# Altium project HYDRA_V4_POWER.PrjPcb (part 2 of 2)

## Sheet HYDRA_REGULATORS.SchDoc
size B; SheetNumber: 5; SheetTotal: 11
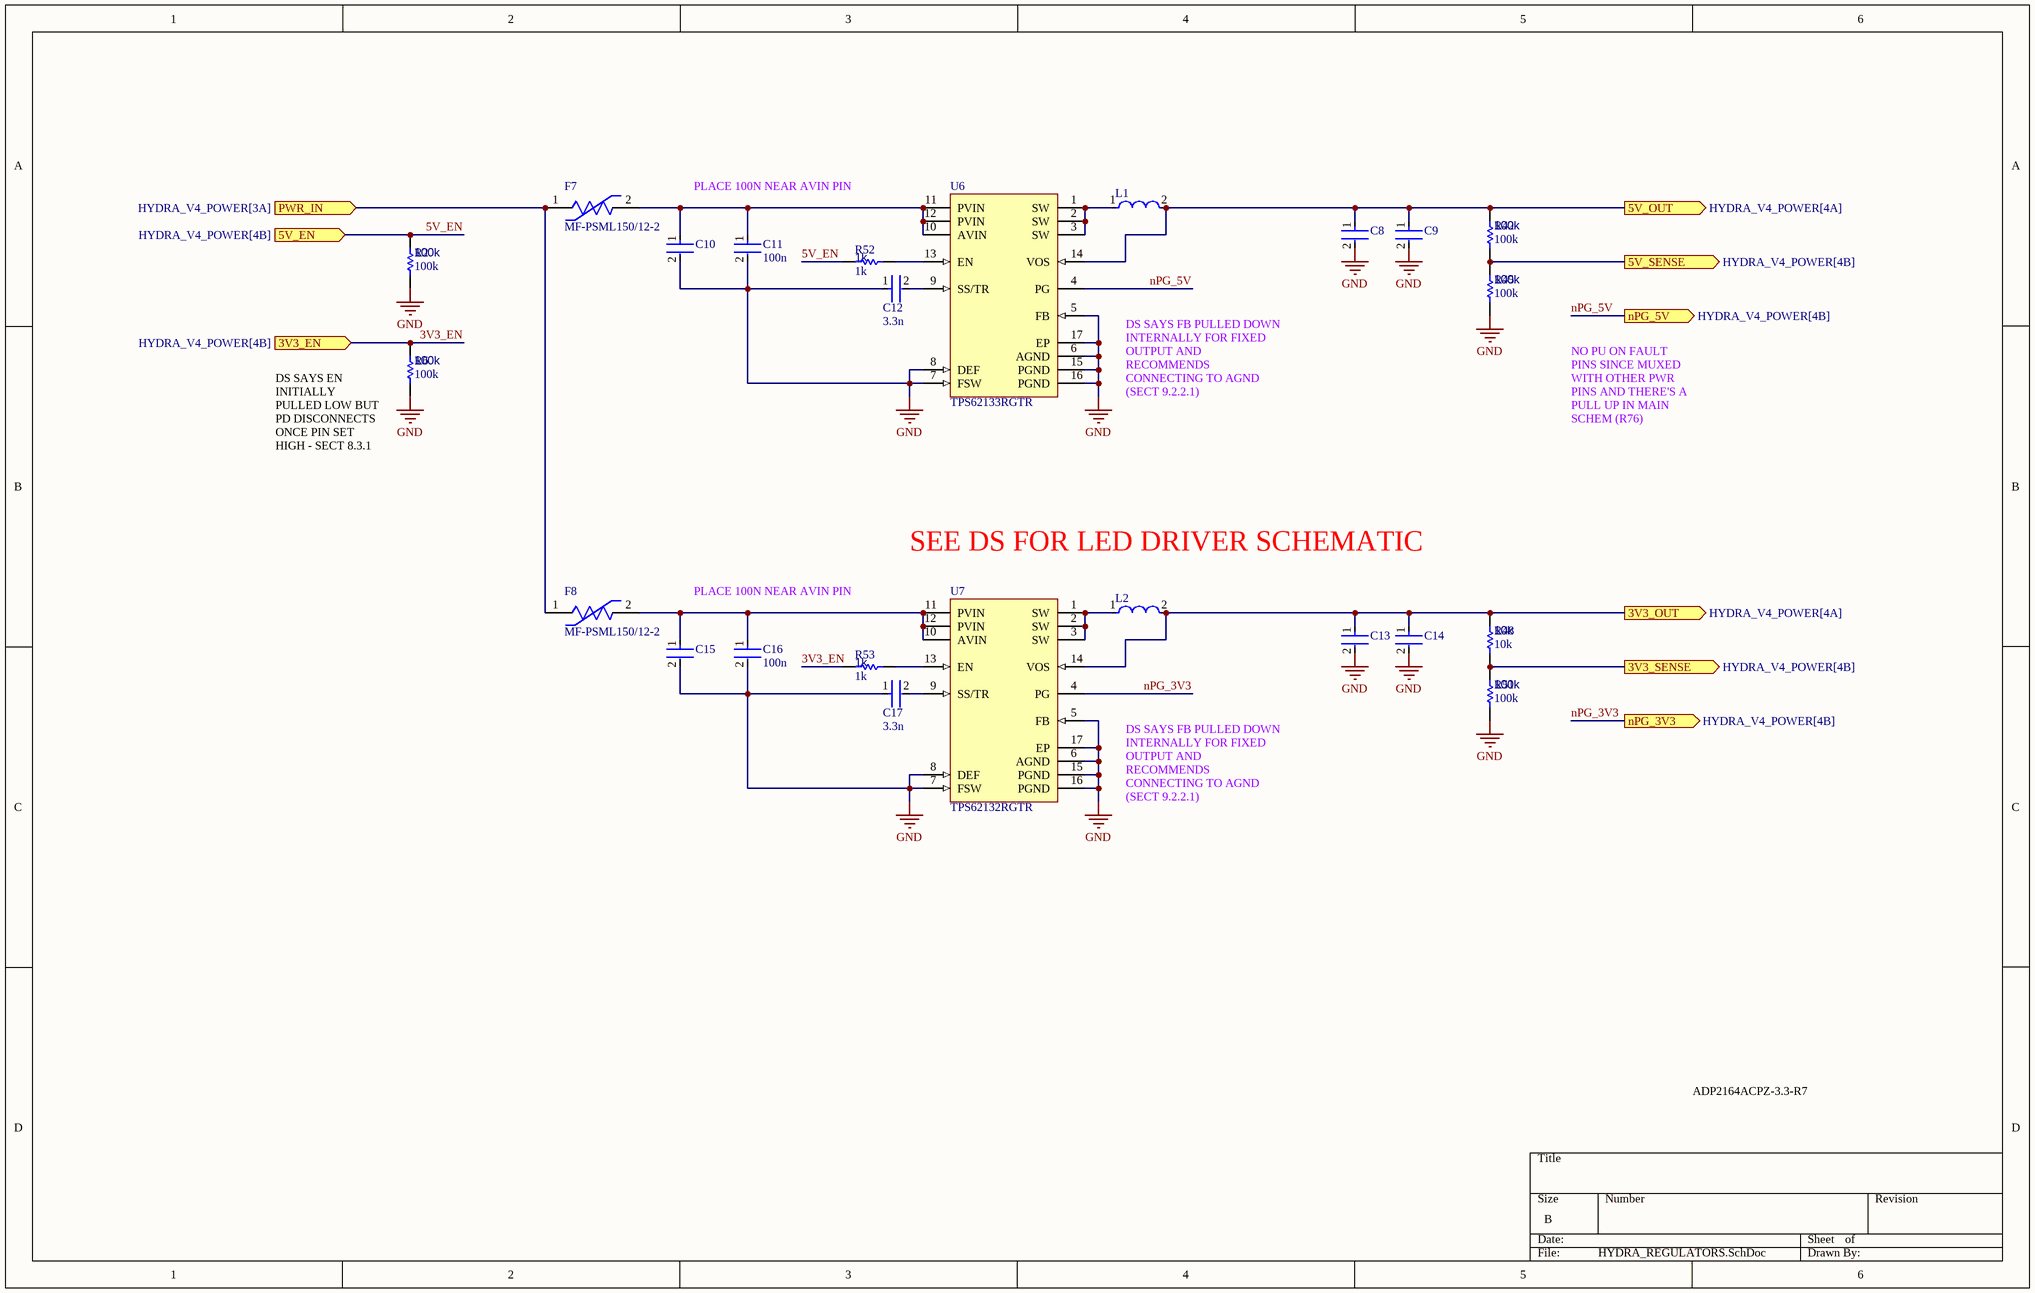
[diagram p10: HYDRA_REGULATORS.SchDoc]

### Parts
C8  GRM21BR61E226ME44L  [FP-GRM21B-0_2-e0_2_0_7-IPC_B]  (value not drawn)
C9  TMK212BBJ106KG-T  [FP-0805-L_2_0_0_2-W_1_25-MFG]  (value not drawn)
C10  TMK212BBJ106KG-T  [FP-0805-L_2_0_0_2-W_1_25-MFG]  (value not drawn)
C11  100n  [FP-0402-L_1_0_0_05-W_0_5-IPC_A]
C12  3.3n  [FP-0402-L_1_0_0_05-W_0_5-IPC_A]
C13  GRM21BR61E226ME44L  [FP-GRM21B-0_2-e0_2_0_7-IPC_B]  (value not drawn)
C14  TMK212BBJ106KG-T  [FP-0805-L_2_0_0_2-W_1_25-MFG]  (value not drawn)
C15  TMK212BBJ106KG-T  [FP-0805-L_2_0_0_2-W_1_25-MFG]  (value not drawn)
C16  100n  [FP-0402-L_1_0_0_05-W_0_5-IPC_A]
C17  3.3n  [FP-0402-L_1_0_0_05-W_0_5-IPC_A]
F7  MF-PSML150/12-2  [FP-MF-PSMF-MFG]
F8  MF-PSML150/12-2  [FP-MF-PSMF-MFG]
L1  IHLP1212BZER2R2M11  [FP-IHLP-1212BZ-11-MFG]  (value not drawn)
L2  IHLP1212BZER2R2M11  [FP-IHLP-1212BZ-11-MFG]  (value not drawn)
R2  100k  [R0603B]
R6  100k  [R0603B]
R42  100k  [R0603B]
R45  100k  [R0603B]
R48  10k  [R0603B]
R51  100k  [R0603B]
R52  1k  [R0603B]
R53  1k  [R0603B]
U6  TPS62133RGTR  [RGT0016C_V]
U7  TPS62132RGTR  [RGT0016C_V]

### Ports
3V3_EN (in, see HYDRA_V4_POWER[4B]), 3V3_OUT (out, see HYDRA_V4_POWER[4A]), 3V3_SENSE (out, see HYDRA_V4_POWER[4B]), 5V_EN (in, see HYDRA_V4_POWER[4B]), 5V_OUT (out, see HYDRA_V4_POWER[4A]), 5V_SENSE (out, see HYDRA_V4_POWER[4B]), nPG_3V3 (out, see HYDRA_V4_POWER[4B]), nPG_5V (out, see HYDRA_V4_POWER[4B]), PWR_IN (in, see HYDRA_V4_POWER[3A])

### Nets
GND: C8.2 C9.2 C10.2 C11.2 C12.1 C13.2 C14.2 C15.2 C16.2 C17.1 R2.2 R6.2 R45.1 R51.1 U6.5(FB) U6.6(AGND) U6.7(FSW) U6.8(DEF) U6.15(PGND) U6.16(PGND) U6.17(EP) U7.5(FB) U7.6(AGND) U7.7(FSW) U7.8(DEF) U7.15(PGND) U7.16(PGND) U7.17(EP)
3V3_EN: R6.1 R53.2 ; port 3V3_EN
5V_EN: R2.1 R52.2 ; port 5V_EN
M3_PWR: F7.1 F8.1 ; port PWR_IN
nPG_3V3: U6.4(PG) U7.4(PG) ; port nPG_5V, port nPG_3V3  [also labelled nPG_5V]  [project net M2_I_nFAULT]
NetC8_1: C8.1 C9.1 L1.2 R42.2 U6.14(VOS) ; port 5V_OUT
NetC10_1: C10.1 C11.1 F7.2 U6.10(AVIN) U6.11(PVIN) U6.12(PVIN)
NetC12_2: C12.2 U6.9(SS/TR)
NetC13_1: C13.1 C14.1 L2.2 R48.2 U7.14(VOS) ; port 3V3_OUT
NetC15_1: C15.1 C16.1 F8.2 U7.10(AVIN) U7.11(PVIN) U7.12(PVIN)
NetC17_2: C17.2 U7.9(SS/TR)
NetL1_1: L1.1 U6.1(SW) U6.2(SW) U6.3(SW)
NetL2_1: L2.1 U7.1(SW) U7.2(SW) U7.3(SW)
NetR42_1: R42.1 R45.2 ; port 5V_SENSE
NetR48_1: R48.1 R51.2 ; port 3V3_SENSE
NetR52_1: R52.1 U6.13(EN)
NetR53_1: R53.1 U7.13(EN)

### Notes on the sheet
- PLACE 100N NEAR AVIN PIN
- DS SAYS FB PULLED DOWN INTERNALLY FOR FIXED OUTPUT AND RECOMMENDS CONNECTING TO AGND (SECT 9.2.2.1)
- NO PU ON FAULT PINS SINCE MUXED WITH OTHER PWR PINS AND THERE'S A PULL UP IN MAIN SCHEM (R76)
- (near R6) DS SAYS EN INITIALLY PULLED LOW BUT PD DISCONNECTS ONCE PIN SET HIGH - SECT 8.3.1
- SEE DS FOR LED DRIVER SCHEMATIC
- ADP2164ACPZ-3.3-R7

### Library data of the parts
C8 C13 = CMP-2007-03222-3: Chip Multilayer Ceramic Capacitors for General Purpose, 0805, 22uF, X5R, 15%, 20%, 25V; Case/Package: 0805; Depth: 1.25mm; Resistor Type: Ceramic; Voltage Rating: 25V; Lead Free: Lead Free; Voltage Rating (DC): 25V; Case Code (Metric): 2012; Thickness: 0.057inch; REACH SVHC: No SVHC; Material: Ceramic; Tolerance: 20%; Length: 2mm; Capacitance: 22uF; Case Code (Imperial): 0805; Max Operating Temperature: 85°C; Termination: SMD/SMT; Weight: 0.000335oz; Dielectric: X5R; Packaging: Tape and Reel; Voltage: 25V; Package Quantity: 3000; Height: 1.25mm; Mount: Surface Mount; Width: 1.25mm; Min Operating Temperature: -55°C; Value: GRM21BR61E226ME44L
C9 C10 C14 C15 = CMP-14477-000079-3: Multilayer Ceramic Capacitor 10uF 25V X5R 10% SMD 0805 T/R; Voltage: 16V; Dielectric: X7R; Number of Pins: 2; Width: 0.049inch; REACH SVHC: No SVHC; Packaging: Tape and Reel; Max Operating Temperature: 85°C; Length: 0.079inch; Termination: SMD/SMT; RoHS Compliant: Yes; Thickness: 0.053inch; Case/Package: 0805; Case Code (Imperial): 0805; Capacitance: 10uF; Lead Free: Lead Free; Voltage Rating: 25V; Resistor Type: Ceramic; Voltage Rating (DC): 25V; Case Code (Metric): 2012; Mount: Surface Mount; Package Quantity: 1; Height: 1.25mm; Series: M; Tolerance: 10%; Min Operating Temperature: -55°C; Value: TMK212BBJ106KG-T
C11 C12 C16 C17 = CMP-001-00058-1: LARGE PADS, 0402 CAP, CHANGE COMMENT TO MATCH REAL P/N; Capacitor Type: Ceramic; Min Operating Temperature: -55°C; Mounting Technology: Surface Mount; Pins: 2; Case/Package: 0402; RoHS Compliant: Yes; Max Operating Temperature: 85°C
  C11 C16: Value: 100n
  C12 C17: Value: 3.3n
F7 F8 = CMP-07400-000013-1: Manufacturer Part Number: MF-PSMF050X-2; Manufacturer: Bourns Inc.; Trip Current: 1A; Trip Time: 0.1s; Value: 0.15-0.9Ω; Hold Current: 0.5A; Current Rating: 40A; Voltage Rating: 6V; Category: Fuse; Temperature: -40°C to +85°C; ComponentLink2Description: Datasheet; Temperature Range High: +85°C; Package: MF-PSMF; Device Class L1: Circuit Protection; Lead Free: Yes; ComponentLink2URL: https://www.bourns.com/docs/product-datasheets/mfpsmf.pdf?sfvrsn=9c05cafe_24; Ambient Temperature Range Low: -40°C; Mouser Description: Resettable Fuses - PPTC .50A 6V 0.15ohm Hold .5 Trip 1; Resistance: 0.15-0.9Ω; Automotive: Yes; Ambient Temperature Range High: +85°C; Device Class L2: PTC Resettable Fuses; Temperature Range Low: -40°C; Device Class L3: unset; Octopart: https://octopart.com/mf-psmf050x-2-bourns-7483438; Digikey Description: PTC RESET FUSE 6V 500MA 0805; Height: 0.85mm; RoHS: TRUE
L1 L2 = CMP-02424-000689-1: FIXED IND 2.2UH 3A 46 MOHM SMD; DC Resistance (DCR): 46mR; Inductance Tolerance: 20%; Saturation Current: 3.3A; Self Resonant Frequency: 55MHz; Core Material: Metal; Shielding: Shielded; Test Frequency: 100kHz; RMS Current (Irms): 3A; Max DC Current: 3A; Contact Plating: Tin; Mount: Surface Mount; Series: IHLP-1212BZ-11; Inductance: 2.2uH; Current Rating: 3A; Height - Seated (Max): 0.079inch; Radiation Hardening: No; Package Quantity: 3000; Max Operating Temperature: 125°C; Military Standard: Not; Depth: 3.2mm; Rated Current-Max: 3A; Height: 2mm; Lead Free: Lead Free; Termination: SMD/SMT; RoHS Compliant: Yes; Tolerance: 20%; Packaging: Tape and Reel; Case/Package: 1212; Number of Pins: 2; Min Operating Temperature: -55°C; Width: 3mm; Length: 3.6mm
R2 R6 R42 R45 R48 R51-R53 = CMP-009-00002-14: Resistor
  R2 R6 R42 R45 R51: Value: 100k
  R48: Value: 10k
  R52 R53: Value: 1k
U6 = CMP-0323-00146-3: Buck Step Down Regulator with 3 to 17 V Input and 5 V Output, -40 to 85 degC, 16-Pin QFN (RGT), Green (RoHS & no Sb/Br); Manufacturer: Texas Instruments; Preset Vout(V): 5; Regulated Outputs(#): 1; Synchronous Rectification: TRUE; Duty Cycle(Max)(%): 100; Vin(Min)(V): 3; Vin(Max)(V): 17; Rating: Catalog; SubFamily: Step-Down Regulator; Switch Current Limit(Typ)(A): 4.2; Iq(Typ)(mA): 0.017; ComponentLink1Description: Datasheet; PackageVersion: revH, Oct-2011; ComponentLink2URL: http://www.ti.com/litv/pdf/mpqf119g; Code_JEDEC: MO-220; ComponentLink2Description: Package Specification; Vout(Max)(V): 5; ComponentLink3URL: Samples URL:http://www.ti.com/product/tps62133#samples; PackageReference: RGT0016C; ComponentLink3Description: URL Link1; Mounting Technology: Surface Mount; DatasheetVersion: SLVSAG7; PartNumber: TPS62133RGTR; Iout(Max)(A): 3; Eco-Plan: Green (RoHS & no Sb/Br); PackageDescription: 16-Pin Plastic Quad Flat No-Lead, 3 x 3 mm Body, 0.5 mm Pitch, 1.7 x 1.7 mm Exposed Pad; Topology: Buck; Vout(Min)(V): 5; ComponentLink1URL: http://www.ti.com/general/docs/lit/getliterature.tsp?genericPartNumber=TPS62133&fileType=pdf
U7 = CMP-0323-00152-3: Buck Step Down Regulator with 3 to 17 V Input and 3.3 V Output, -40 to 85 degC, 16-Pin QFN (RGT), Green (RoHS & no Sb/Br); Manufacturer: Texas Instruments; Switch Current Limit(Typ)(A): 4.2; Vout(Max)(V): 3.3; Iout(Max)(A): 3; Regulated Outputs(#): 1; Rating: Catalog; Vin(Max)(V): 17; Synchronous Rectification: TRUE; SubFamily: Step-Down Regulator; Duty Cycle(Max)(%): 100; Iq(Typ)(mA): 0.017; DatasheetVersion: SLVSAG7; ComponentLink3Description: URL Link1; PartNumber: TPS62132RGTR; ComponentLink1Description: Datasheet; Vin(Min)(V): 3; PackageDescription: 16-Pin Plastic Quad Flat No-Lead, 3 x 3 mm Body, 0.5 mm Pitch, 1.7 x 1.7 mm Exposed Pad; Mounting Technology: Surface Mount; Preset Vout(V): 3.3; Code_JEDEC: MO-220; ComponentLink1URL: http://www.ti.com/general/docs/lit/getliterature.tsp?genericPartNumber=TPS62132&fileType=pdf; Vout(Min)(V): 3.3; Eco-Plan: Green (RoHS & no Sb/Br); ComponentLink2URL: http://www.ti.com/litv/pdf/mpqf119g; ComponentLink2Description: Package Specification; PackageReference: RGT0016C; PackageVersion: revH, Oct-2011; Topology: Buck; ComponentLink3URL: Samples URL:http://www.ti.com/product/tps62132#samples

## Sheet RP_AND_SAFETYSW.SchDoc
size B; SheetNumber: 6; SheetTotal: 11
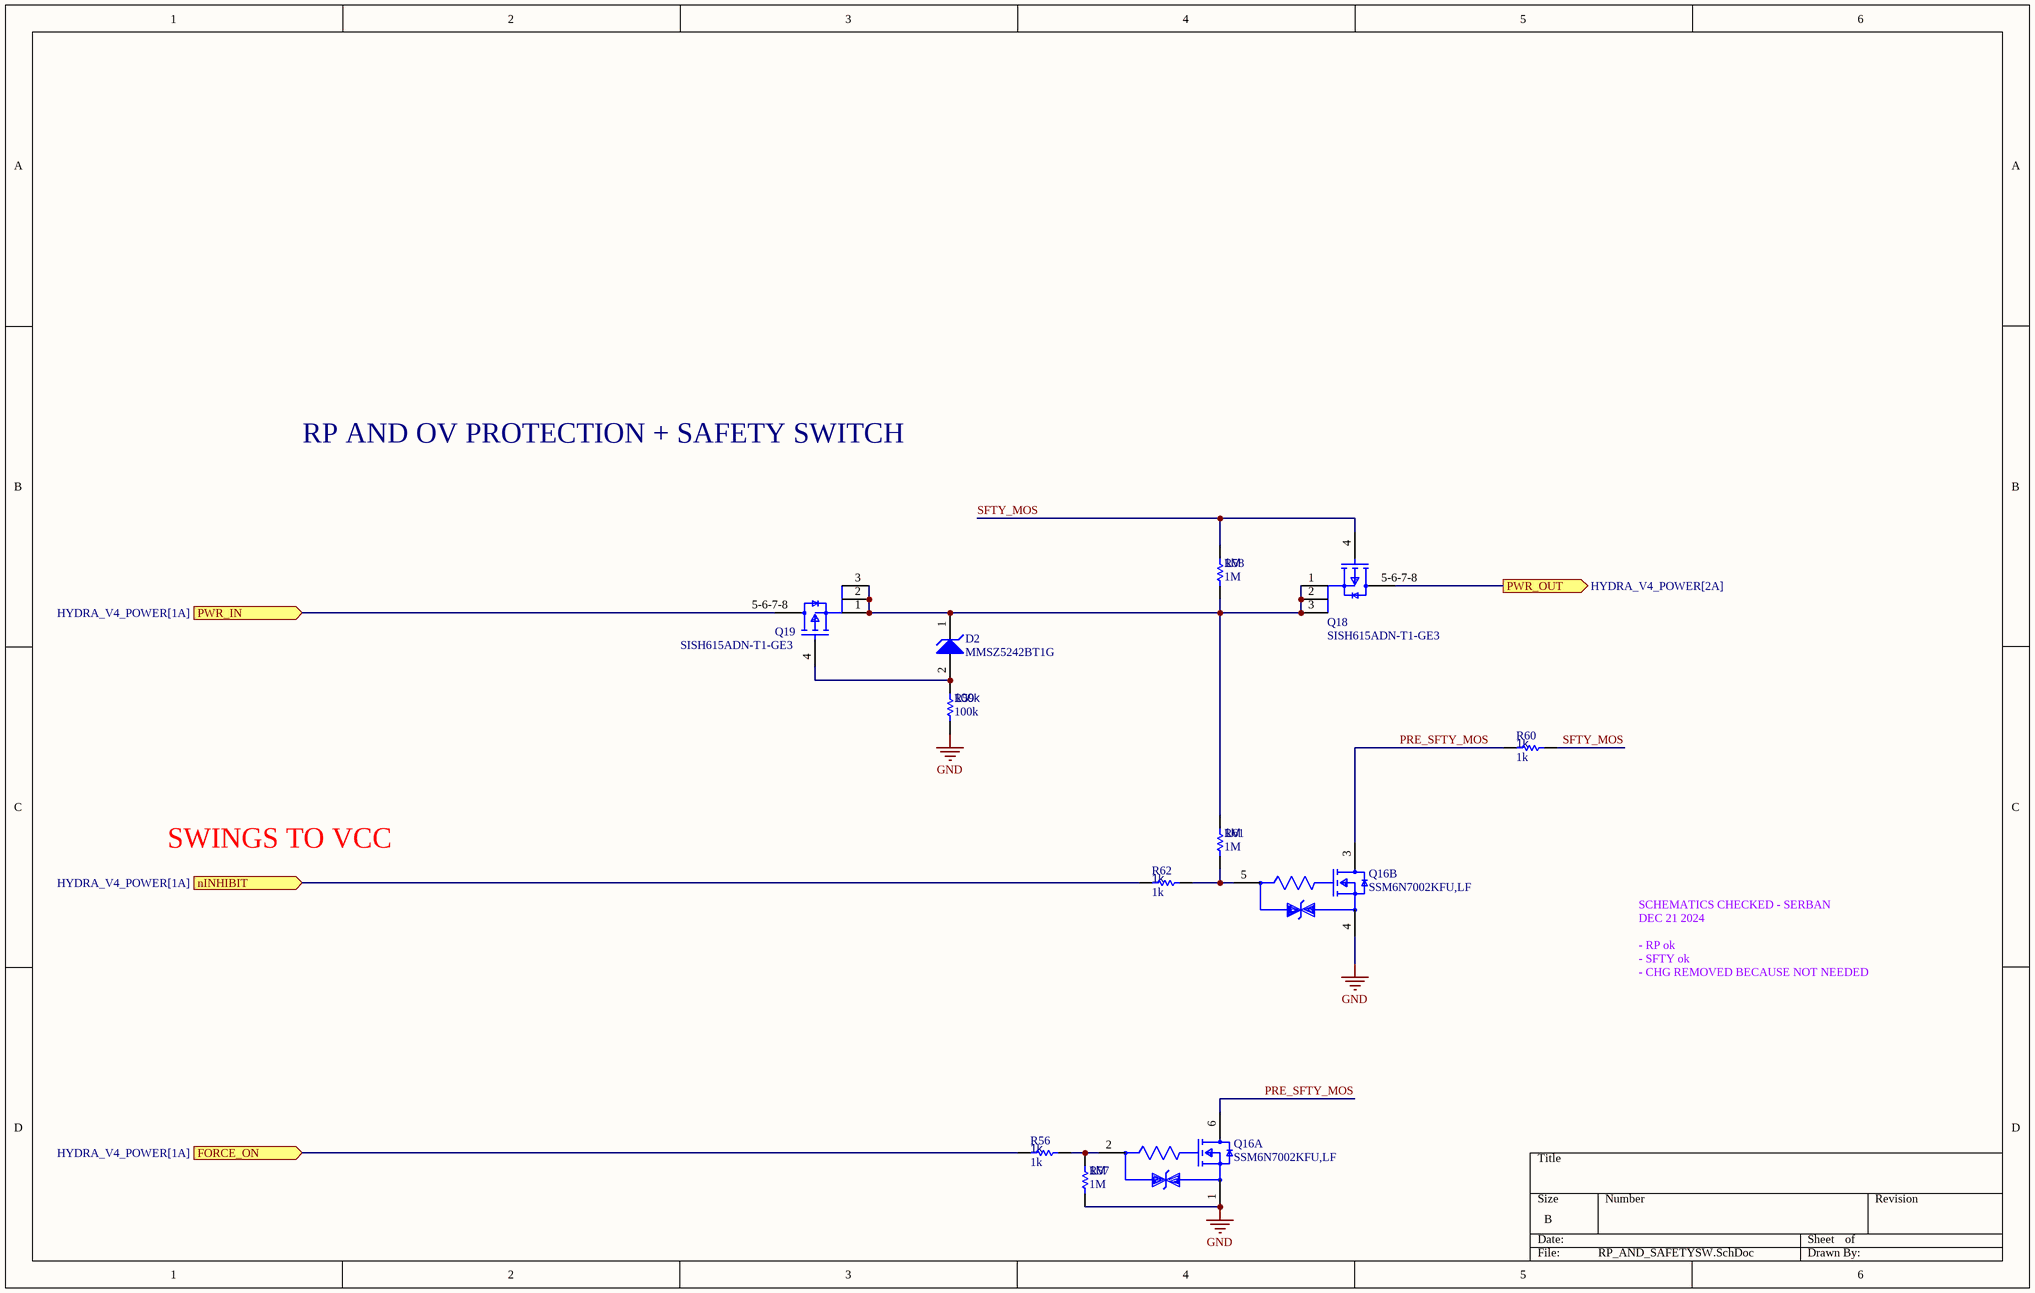
[diagram p11: RP_AND_SAFETYSW.SchDoc]

### Parts
D2  MMSZ5242BT1G  [ONSC-SOD-123-2-425-04_V]
Q16  SSM6N7002KFU,LF  [FP-SSOP6-P-0_65A-MFG]  (parts A,B of 2)
Q18  SISH615ADN-T1-GE3  [SISH615ADN-T1-GE3-Footprint-1]
Q19  SISH615ADN-T1-GE3  [SISH615ADN-T1-GE3-Footprint-1]
R56  1k  [R0603B]
R57  1M  [R0603B]
R58  1M  [R0603B]
R59  100k  [R0603B]
R60  1k  [R0603B]
R61  1M  [R0603B]
R62  1k  [R0603B]

### Ports
FORCE_ON (in, see HYDRA_V4_POWER[1A]), nINHIBIT (in, see HYDRA_V4_POWER[1A]), PWR_IN (in, see HYDRA_V4_POWER[1A]), PWR_OUT (out, see HYDRA_V4_POWER[2A])

### Nets
GND: Q16.1(Source1) Q16.4(Source2) R57.2 R59.1
FORCE_ON: R56.2 ; port FORCE_ON
nINHIBIT: R62.2 ; port nINHIBIT
OC_PROT_PWR_IN: Q18.5-6-7-8(D) ; port PWR_OUT
PRE_SFTY_MOS: Q16.3(Drain2) Q16.6(Drain1) R60.2
SFTY_MOS: Q18.4(G) R58.2 R60.1
NetD2_1: D2.1(K) Q18.1(S) Q18.2(S) Q18.3(S) Q19.1(S) Q19.2(S) Q19.3(S) R58.1 R61.1
NetD2_2: D2.2(A) Q19.4(G) R59.2
NetF1_2: Q19.5-6-7-8(D) ; port PWR_IN
NetQ16_2: Q16.2(Gate1) R56.1 R57.1
NetQ16_5: Q16.5(Gate2) R61.2 R62.1

### Notes on the sheet
- RP AND OV PROTECTION + SAFETY SWITCH
- SWINGS TO VCC
- SCHEMATICS CHECKED - SERBAN
  DEC 21 2024
  - RP ok
  - SFTY ok
  - CHG REMOVED BECAUSE NOT NEEDED

### Library data of the parts
D2 = CMP-1060-00565-1: Zener Voltage Regulator, 500 mW, 2-Pin SOD-123, Pb-Free, Tape and Reel; Manufacturer: On Semiconductor; P Max (W): 0.5; VZ Typ (V): 12; PartNumber: MMSZ5242BT1G; PackageReference: SOD-123-2-425-04; ComponentLink3URL: http://www.onsemi.com/pub_link/Collateral/425-04.PDF; Mounting Technology: Surface Mount; ComponentLink2Description: Datasheet; ComponentLink1URL: http://www.onsemi.com/; ComponentLink3Description: Package Specification; PackageDescription: 2-Pin SOD, Body 1.6 x 2.69 mm; PackageVersion: Rev. G, 10/2009; ComponentLink1Description: Manufacturer URL; RoHS: Pb-Free; ComponentLink2URL: http://www.onsemi.com/pub_link/Collateral/MMSZ5221BT1-D.PDF; Packing: Tape and Reel; DatasheetVersion: Rev. 12
Q16 = CMP-35916-000009-1: MOSFET 2N-CH 60V 0.3A; Input Capacitance: 40pF; Continuous Drain Current (ID): 300mA; Max Power Dissipation: 285mW; FET Type: 2 N-Channel; Rds On Max: 1.5R; Mount: Surface Mount; Drain to Source Voltage (Vdss): 60V; Packaging: Tape and Reel
Q18 Q19 = CMP-013-00018-2: Trans MOSFET P-CH 20V 22.1A 8-Pin PowerPAK 1212 EP T/R; Source: SISH615ADN-T1-GE3.SchLib; Design Item ID: CMP-013-00036-4; Component Type: Standard; Pins: 5
R56-R62 = CMP-009-00002-14: Resistor
  R56 R60 R62: Value: 1k
  R57 R58 R61: Value: 1M
  R59: Value: 100k

## Sheet LM7310.SchDoc
size A; SheetNumber: 8; SheetTotal: 11
Used 3 times, as channels LS_0, LS_1, LS_2. Parts and nets are listed once, with the designators drawn on the sheet.
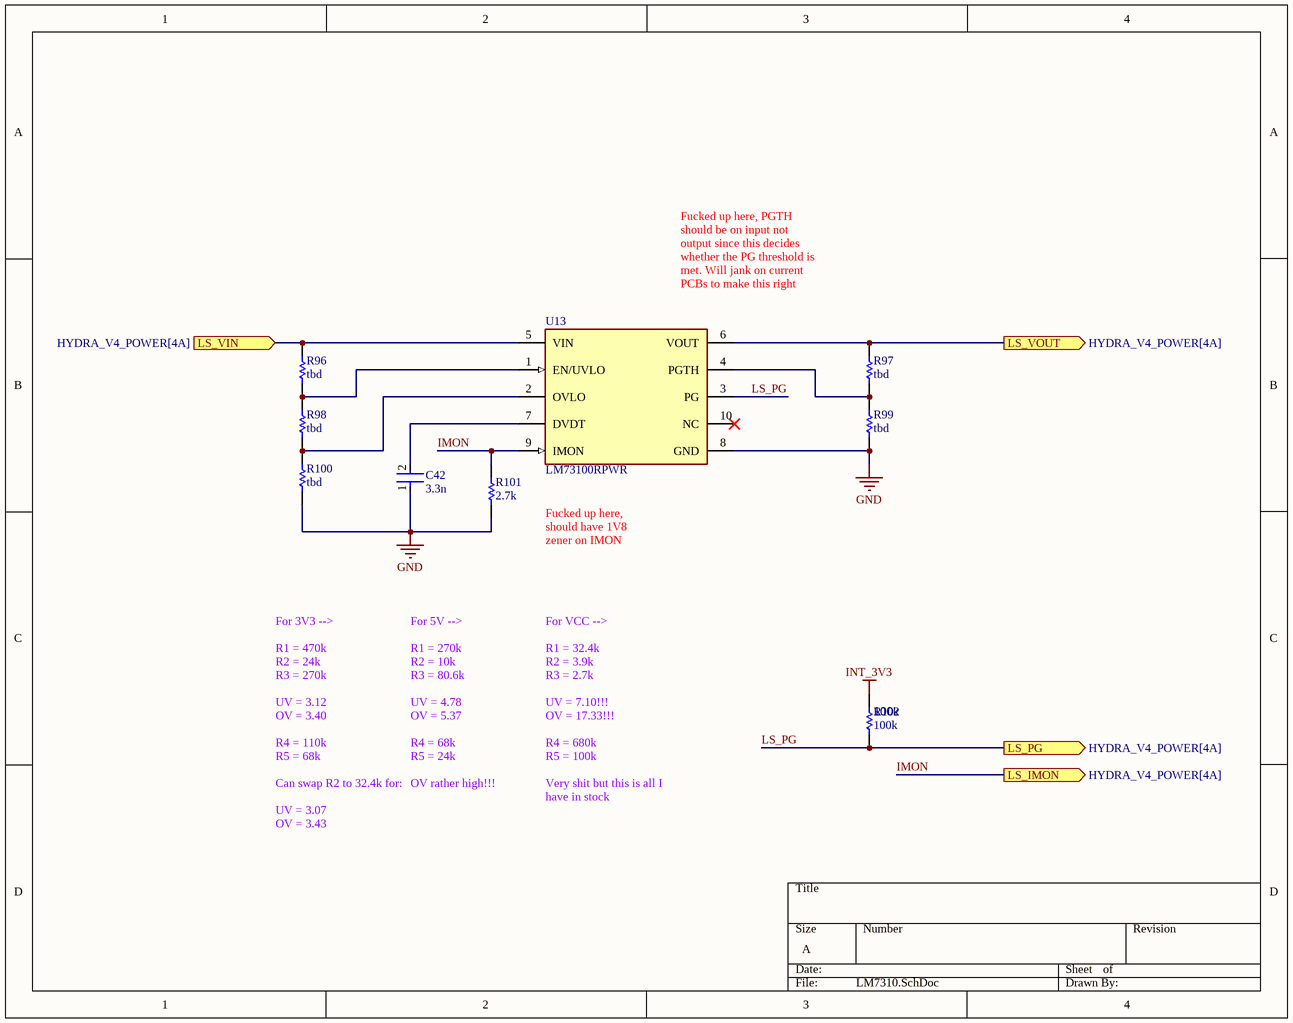
[diagram p12: LM7310.SchDoc]

### Parts
C42  3.3n  [FP-0402-L_1_0_0_05-W_0_5-IPC_A]
R96  tbd  [R0603B]
R97  tbd  [R0603B]
R98  tbd  [R0603B]
R99  tbd  [R0603B]
R100  tbd  [R0603B]
R101  2.7k  [R0603B]
R102  100k  [R0603B]
U13  LM73100RPWR  [FP-RPW0010A-MFG]

### Ports
LS_IMON (out, see HYDRA_V4_POWER[4A]), LS_PG (out, see HYDRA_V4_POWER[4A]), LS_VIN (in, see HYDRA_V4_POWER[4A]), LS_VOUT (out, see HYDRA_V4_POWER[4A])

### Nets
GND: C42.1 R99.1 R100.1 R101.1 U13.8(GND)
INT_3V3: R102.2
IMON: R101.2 U13.9(IMON) ; port LS_IMON
LS_PG: R102.1 U13.3(PG) ; port LS_PG
LS_VIN: R96.2 U13.5(VIN) ; port LS_VIN
LS_VOUT: R97.2 U13.6(VOUT) ; port LS_VOUT
NetC42_2: C42.2 U13.7(DVDT)
NetR96_1: R96.1 R98.2 U13.1(EN/UVLO)
NetR97_1: R97.1 R99.2 U13.4(PGTH)
NetR98_1: R98.1 R100.2 U13.2(OVLO)

Not connected (* = marked no-connect by the designer): U13 10(NC)*

### Channels
LS_0: designators end in _LS_0; ports LS_IMON=IMON LS_PG=HYDRA_VCC_PG LS_VIN=NetF3_2 LS_VOUT=HYDRA_VCC
LS_1: designators end in _LS_1; ports LS_IMON=IMON LS_PG=HYDRA_5V_PG LS_VIN=NetC8_1 LS_VOUT=HYDRA_5V
LS_2: designators end in _LS_2; ports LS_IMON=IMON LS_PG=HYDRA_3V3_PG LS_VIN=NetC13_1 LS_VOUT=HYDRA_3V3

### Notes on the sheet
- Fucked up here, PGTH should be on input not output since this decides whether the PG threshold is met. Will jank on current PCBs to make this right
- Fucked up here, should have 1V8 zener on IMON
- For 3V3 -->
  R1 = 470k
  R2 = 24k
  R3 = 270k
  UV = 3.12
  OV = 3.40
  R4 = 110k
  R5 = 68k
  Can swap R2 to 32.4k for:
  UV = 3.07
  OV = 3.43
- For 5V -->
  R1 = 270k
  R2 = 10k
  R3 = 80.6k
  UV = 4.78
  OV = 5.37
  R4 = 68k
  R5 = 24k
  OV rather high!!!
- For VCC -->
  R1 = 32.4k
  R2 = 3.9k
  R3 = 2.7k
  UV = 7.10!!!
  OV = 17.33!!!
  R4 = 680k
  R5 = 100k
  Very shit but this is all I have in stock

### Library data of the parts
C42 = CMP-001-00058-1: as C11 on sheet HYDRA_REGULATORS; Value: 3.3n; Min Operating Temperature: -55°C; Mounting Technology: Surface Mount; Pins: 2; Case/Package: 0402; RoHS Compliant: Yes; Max Operating Temperature: 85°C
R96-R100 R102 = CMP-009-00002-14: Resistor
  R96-R100: Value: tbd
  R102: Value: 100k
R101 = CMP-009-00002-14: Resistor; Value: tbd
U13 = CMP-04910-000122-1: 2.7-V TO 23-V, 5.5-A IDEAL DIODE; RoHS Compliant: Yes

## Sheet TCAN330_PINOUT.SchDoc
size A4; SheetNumber: 10; SheetTotal: 11
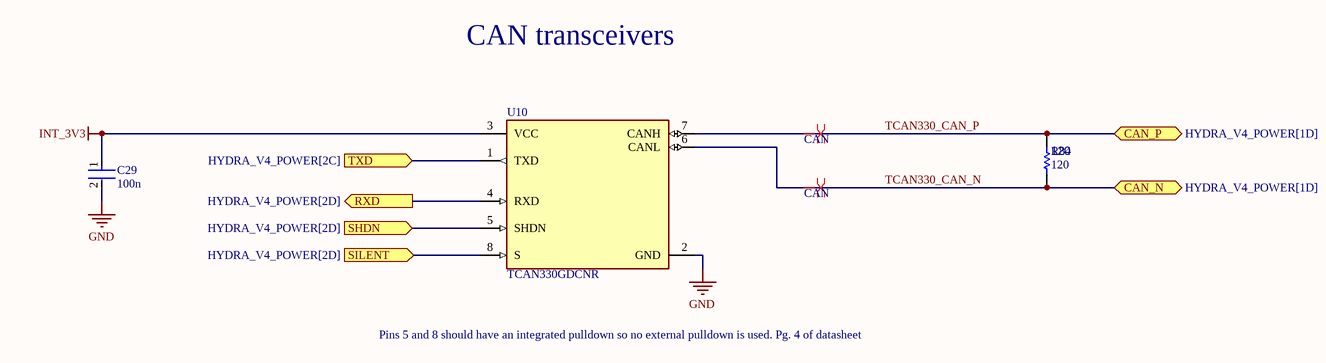
[diagram p13: TCAN330_PINOUT.SchDoc]

### Parts
C29  100n  [FP-0402-L_1_0_0_05-W_0_5-IPC_A]
R84  120  [R0603B]
U10  TCAN330GDCNR  [FP-DCN0008A-MFG]

### Ports
CAN_N (bidir, see HYDRA_V4_POWER[1D]), CAN_P (bidir, see HYDRA_V4_POWER[1D]), RXD (out, see HYDRA_V4_POWER[2D]), SHDN (in, see HYDRA_V4_POWER[2D]), SILENT (in, see HYDRA_V4_POWER[2D]), TXD (in, see HYDRA_V4_POWER[2C])

### Nets
GND: C29.2 U10.2(GND)
INT_3V3: C29.1 U10.3(VCC)
TCAN330_CAN_N: R84.1 U10.6(CANL) ; port CAN_N  [project net CAN1_N]
TCAN330_CAN_P: R84.2 U10.7(CANH) ; port CAN_P  [project net CAN1_P]
NetU9_58: U10.4(RXD) ; port RXD
NetU9_59: U10.1(TXD) ; port TXD
NetU10_5: U10.5(SHDN) ; port SHDN
NetU10_8: U10.8(S) ; port SILENT

### Layout directives
differential pair; net class CAN: CAN1_N, CAN1_P

### Notes on the sheet
- CAN transceivers
- Pins 5 and 8 should have an integrated pulldown so no external pulldown is used. Pg. 4 of datasheet

### Library data of the parts
C29 = CMP-001-00058-1: as C11 on sheet HYDRA_REGULATORS; Value: 100n; Min Operating Temperature: -55°C; Mounting Technology: Surface Mount; Pins: 2; Case/Package: 0402; RoHS Compliant: Yes; Max Operating Temperature: 85°C
R84 = CMP-009-00002-14: Resistor; Value: 120
U10 = CMP-04872-000178-1: IC TRANSCEIVER 1/1 SOT23-8; Data Rate: 1Mbps; Packaging: Tape and Reel; Min Operating Temperature: -40°C; Max Operating Temperature: 125°C; RoHS Compliant: Yes; Lead Free: Lead Free; Case/Package: SOT-23-8; Mount: Surface Mount

## Sheet TCAN1146_PINOUT.SchDoc
size A4; SheetNumber: 9; SheetTotal: 11
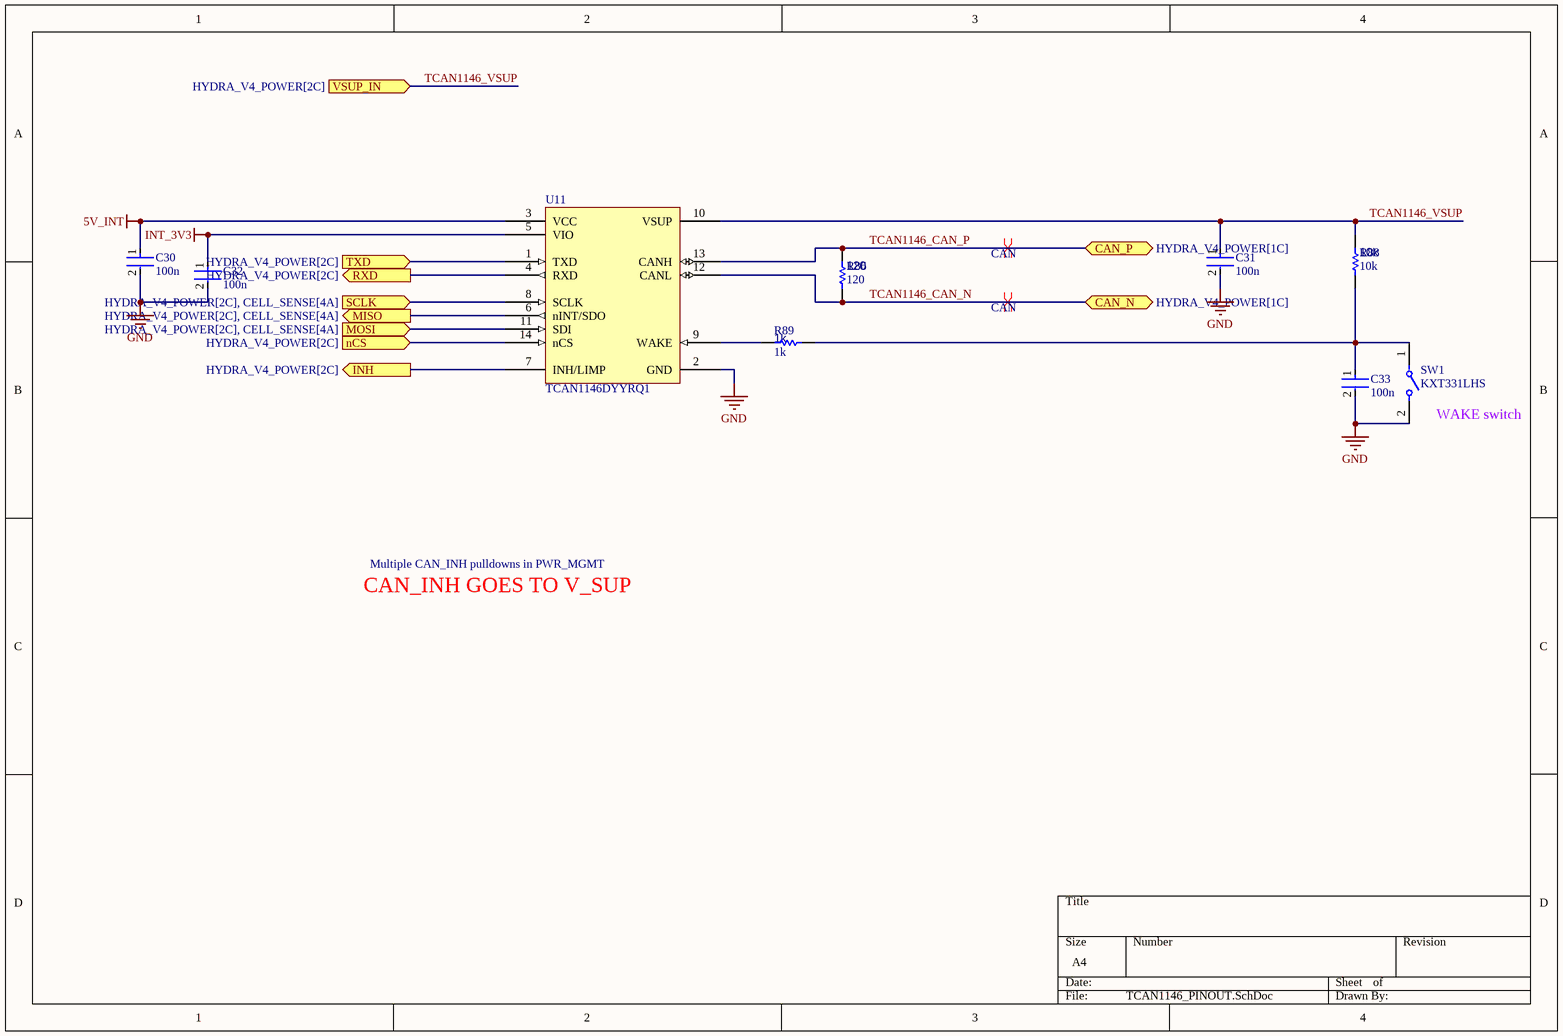
[diagram p14: TCAN1146_PINOUT.SchDoc]

### Parts
C30  100n  [FP-0402-L_1_0_0_05-W_0_5-IPC_A]
C31  100n  [FP-0402-L_1_0_0_05-W_0_5-IPC_A]
C32  100n  [FP-0402-L_1_0_0_05-W_0_5-IPC_A]
C33  100n  [FP-0402-L_1_0_0_05-W_0_5-IPC_A]
R86  120  [R0603B]
R88  10k  [R0603B]
R89  1k  [R0603B]
SW1  KXT331LHS  [FP-KXT331LHS-MFG]
U11  TCAN1146DYYRQ1  [TCAN1146DYYRQ1-Footprint-1]

### Ports
CAN_N (bidir, see HYDRA_V4_POWER[1C]), CAN_P (bidir, see HYDRA_V4_POWER[1C]), INH (out, see HYDRA_V4_POWER[2C]), MISO (out, see HYDRA_V4_POWER[2C], CELL_SENSE[4A]), MOSI (in, see HYDRA_V4_POWER[2C], CELL_SENSE[4A]), nCS (in, see HYDRA_V4_POWER[2C]), RXD (out, see HYDRA_V4_POWER[2C]), SCLK (in, see HYDRA_V4_POWER[2C], CELL_SENSE[4A]), TXD (in, see HYDRA_V4_POWER[2C]), VSUP_IN (in, see HYDRA_V4_POWER[2C])

### Nets
5V_INT: C30.1 U11.3(VCC)
GND: C30.2 C31.2 C32.2 C33.2 SW1.2 U11.2(GND)
INT_3V3: C32.1 U11.5(VIO)
TCAN1146_VSUP: C31.1 R88.2 U11.10(VSUP) ; port VSUP_IN  [project net TCAN1146_PWR]
ADC_MISO: U11.6(nINT/SDO) ; port MISO
ADC_MOSI: U11.11(SDI) ; port MOSI
ADC_SCLK: U11.8(SCLK) ; port SCLK
TCAN1146_CAN_N: R86.1 U11.12(CANL) ; port CAN_N  [project net CAN0_N]
TCAN1146_CAN_P: R86.2 U11.13(CANH) ; port CAN_P  [project net CAN0_P]
TCAN1146_INH: U11.7(INH/LIMP) ; port INH
NetC33_1: C33.1 R88.1 R89.1 SW1.1
NetR89_2: R89.2 U11.9(WAKE)
NetU9_38: U11.14(nCS) ; port nCS
NetU9_45: U11.4(RXD) ; port RXD
NetU9_46: U11.1(TXD) ; port TXD

### Layout directives
differential pair; differential pair class CAN: CAN0_N, CAN0_P

### Notes on the sheet
- (near SW1) WAKE switch
- Multiple CAN_INH pulldowns in PWR_MGMT
- CAN_INH GOES TO V_SUP

### Library data of the parts
C30-C33 = CMP-001-00058-1: as C11 on sheet HYDRA_REGULATORS; Value: 100n; Min Operating Temperature: -55°C; Mounting Technology: Surface Mount; Pins: 2; Case/Package: 0402; RoHS Compliant: Yes; Max Operating Temperature: 85°C
R86 R88 R89 = CMP-009-00002-14: Resistor
  R86: Value: 120
  R88: Value: 10k
  R89: Value: 1k
SW1 = CMP-10040-000029-1: SWITCH TACTILE SPST-NO 0.02A 15V; Operating Force: 240gf; Switch Travel: 0.13mm; Illumination Type: Non-Illuminated; Throw Configuration: SPST; Number of Ports: 1; Current Rating: 5A; Mechanical Life: 500000Cycles; Switch Function: Off-Mom; Connector Type: USB; Actuator Type: Standard; Gender: Receptacle; Number of Contacts: 24; Contact Plating: Gold; Insulation Color: Black; Min Operating Temperature: -40°C; Packaging: Tape and Reel; Flammability Rating: UL94 V-0; Max Operating Temperature: 85°C; Termination: Solder; Mount: Surface Mount
U11 = CMP-318-000000-2: Automotive CAN FD transceiver with watchdog, bus diagnostics and partial networking via sele 14-SOT-23-THIN -40 to 150; Component Type: Standard; Design Item ID: CMP-015-00012-2; Pin Count: 14; Source: TCAN1146DYYRQ1.SchLib

## Nets that join several sheets
5V_INT: INT_REG (C39.1 R24.2 U12.2), TCAN1146_PINOUT (C30.1 U11.3)
GND: HYDRA_V4_POWER (50 pins), STM32G473RET6_PINOUT (28 pins), PWR_PROT (14 pins), CELL_SENSE (21 pins), MOSFET_JUNCTION (23 pins), INT_REG (9 pins), HYDRA_REGULATORS (28 pins), RP_AND_SAFETYSW (Q16.1 Q16.4 R57.2 R59.1), LS_0 (5 pins), LS_1 (5 pins), LS_2 (5 pins), TCAN330_PINOUT (C29.2 U10.2), TCAN1146_PINOUT (6 pins)
HYDRA_3V3: HYDRA_V4_POWER (8 pins), LS_2 (R97_LS_2.2 U13_LS_2.6)
HYDRA_5V: HYDRA_V4_POWER (8 pins), LS_1 (R97_LS_1.2 U13_LS_1.6)
HYDRA_VCC: HYDRA_V4_POWER (J1.01 J1.02 J4.01 J4.02), LS_0 (R97_LS_0.2 U13_LS_0.6)
INT_3V3: HYDRA_V4_POWER (Q14.2 R76.2 U8.5), STM32G473RET6_PINOUT (19 pins), PWR_PROT (C4.1 U4.12), CELL_SENSE (C51.1 C52.1 U14.1 U14.20), MOSFET_JUNCTION (C1.1 C2.1 U1.12 U2.12), INT_REG (C7.1 R38.2 U5.2), LS_0 (R102_LS_0.2), LS_1 (R102_LS_1.2), LS_2 (R102_LS_2.2), TCAN330_PINOUT (C29.1 U10.3), TCAN1146_PINOUT (C32.1 U11.5)
INT_PWR: HYDRA_V4_POWER (F3.1 F4.2 F5.1 R67.2), MOSFET_JUNCTION (Q3.5-6-7-8)
TCAN1146_PWR: STM32G473RET6_PINOUT (Q13.2 R37.2), MOSFET_JUNCTION (10 pins), TCAN1146_PINOUT (C31.1 R88.2 U11.10)
3V3_EN: STM32G473RET6_PINOUT (U9.60), HYDRA_REGULATORS (R6.1 R53.2)
5V_EN: STM32G473RET6_PINOUT (U9.61), HYDRA_REGULATORS (R2.1 R52.2)
ADC_MISO: STM32G473RET6_PINOUT (U9.36), CELL_SENSE (U14.15), TCAN1146_PINOUT (U11.6)
ADC_MOSI: STM32G473RET6_PINOUT (U9.37), CELL_SENSE (U14.16), TCAN1146_PINOUT (U11.11)
ADC_SCLK: STM32G473RET6_PINOUT (U9.35), CELL_SENSE (U14.14), TCAN1146_PINOUT (U11.8)
CAN0_N: HYDRA_V4_POWER (J1.16 J4.16), TCAN1146_PINOUT (R86.1 U11.12)
CAN0_P: HYDRA_V4_POWER (J1.15 J4.15), TCAN1146_PINOUT (R86.2 U11.13)
CAN1_N: HYDRA_V4_POWER (J1.20 J4.20), TCAN330_PINOUT (R84.1 U10.6)
CAN1_P: HYDRA_V4_POWER (J1.19 J4.19), TCAN330_PINOUT (R84.2 U10.7)
CELL_0_IN: HYDRA_V4_POWER (J8.1), CELL_SENSE (R73.2)
CELL_1_IN: HYDRA_V4_POWER (J8.2), CELL_SENSE (R71.2)
CELL_2_IN: HYDRA_V4_POWER (J8.3), CELL_SENSE (R65.2)
CELL_3_IN: HYDRA_V4_POWER (J8.4), CELL_SENSE (R63.2)
CUR_TRIP_RST: STM32G473RET6_PINOUT (U9.53), PWR_PROT (R33.2)
FORCE_ON: STM32G473RET6_PINOUT (U9.52), RP_AND_SAFETYSW (R56.2)
HYDRA_3V3_PG: HYDRA_V4_POWER (U8.1), STM32G473RET6_PINOUT (U9.44), LS_2 (R102_LS_2.1 U13_LS_2.3)
HYDRA_5V_PG: HYDRA_V4_POWER (U8.6), STM32G473RET6_PINOUT (U9.41), LS_1 (R102_LS_1.1 U13_LS_1.3)
HYDRA_VCC_PG: HYDRA_V4_POWER (U8.3), STM32G473RET6_PINOUT (U9.39), LS_0 (R102_LS_0.1 U13_LS_0.3)
IMON: STM32G473RET6_PINOUT (U9.42), LS_1 (R101_LS_1.2 U13_LS_1.9)
IMON: STM32G473RET6_PINOUT (U9.43), LS_2 (R101_LS_2.2 U13_LS_2.9)
IMON: STM32G473RET6_PINOUT (U9.33), LS_0 (R101_LS_0.2 U13_LS_0.9)
M1_INH: HYDRA_V4_POWER (R68.2), STM32G473RET6_PINOUT (U9.62), MOSFET_JUNCTION (R16.2)
M1_PWR: PWR_PROT (U4.1 U4.2), MOSFET_JUNCTION (Q5.5-6-7-8)
M2_I_nFAULT: HYDRA_V4_POWER (R75.2), STM32G473RET6_PINOUT (U9.57), PWR_PROT (U4.6), MOSFET_JUNCTION (U1.6 U2.6), HYDRA_REGULATORS (U6.4 U7.4)
M2_PWR: HYDRA_V4_POWER (F2.1), MOSFET_JUNCTION (R54.2 U1.3 U1.4)
M3_I_SENSE: STM32G473RET6_PINOUT (U9.14), MOSFET_JUNCTION (U2.11)
M3_PWR: MOSFET_JUNCTION (U2.3 U2.4), HYDRA_REGULATORS (F7.1 F8.1)
NetC6_1: HYDRA_V4_POWER (F5.2), INT_REG (5 pins)
NetC8_1: HYDRA_REGULATORS (5 pins), LS_1 (R96_LS_1.2 U13_LS_1.5)
NetC13_1: HYDRA_REGULATORS (5 pins), LS_2 (R96_LS_2.2 U13_LS_2.5)
NetD6_1: STM32G473RET6_PINOUT (U9.13), PWR_PROT (D6.1 R23.1)
NetF1_2: HYDRA_V4_POWER (F1.2), RP_AND_SAFETYSW (Q19.5-6-7-8)
NetF3_2: HYDRA_V4_POWER (F3.2), LS_0 (R96_LS_0.2 U13_LS_0.5)
NetR12_2: STM32G473RET6_PINOUT (U9.54), MOSFET_JUNCTION (R12.2)
NetR17_2: STM32G473RET6_PINOUT (U9.55), MOSFET_JUNCTION (R17.2)
NetR24_1: STM32G473RET6_PINOUT (U9.21), INT_REG (R24.1 R31.2)
NetR38_1: STM32G473RET6_PINOUT (U9.8), INT_REG (R38.1 R39.2)
NetR40_1: STM32G473RET6_PINOUT (U9.19), INT_REG (R40.1 R41.2)
NetR42_1: STM32G473RET6_PINOUT (U9.23), HYDRA_REGULATORS (R42.1 R45.2)
NetR47_2: HYDRA_V4_POWER (R47.2), STM32G473RET6_PINOUT (U9.51)
NetR48_1: STM32G473RET6_PINOUT (U9.22), HYDRA_REGULATORS (R48.1 R51.2)
NetR54_1: STM32G473RET6_PINOUT (U9.10), MOSFET_JUNCTION (R54.1 R55.2)
NetU1_11: STM32G473RET6_PINOUT (U9.9), MOSFET_JUNCTION (U1.11)
NetU4_11: STM32G473RET6_PINOUT (U9.12), PWR_PROT (U4.11)
NetU9_30: STM32G473RET6_PINOUT (U9.30), CELL_SENSE (U14.11)
NetU9_34: STM32G473RET6_PINOUT (U9.34), CELL_SENSE (U14.12)
NetU9_38: STM32G473RET6_PINOUT (U9.38), TCAN1146_PINOUT (U11.14)
NetU9_45: STM32G473RET6_PINOUT (U9.45), TCAN1146_PINOUT (U11.4)
NetU9_46: STM32G473RET6_PINOUT (U9.46), TCAN1146_PINOUT (U11.1)
NetU9_58: STM32G473RET6_PINOUT (U9.58), TCAN330_PINOUT (U10.4)
NetU9_59: STM32G473RET6_PINOUT (U9.59), TCAN330_PINOUT (U10.1)
nINHIBIT: HYDRA_V4_POWER (J7.1), RP_AND_SAFETYSW (R62.2)
OC_PROT_PWR_IN: PWR_PROT (5 pins), RP_AND_SAFETYSW (Q18.5-6-7-8)
TCAN1146_INH: STM32G473RET6_PINOUT (R36.2), MOSFET_JUNCTION (R21.2), TCAN1146_PINOUT (U11.7)
V_SENSE: STM32G473RET6_PINOUT (U9.11), PWR_PROT (R28.1 R29.2)